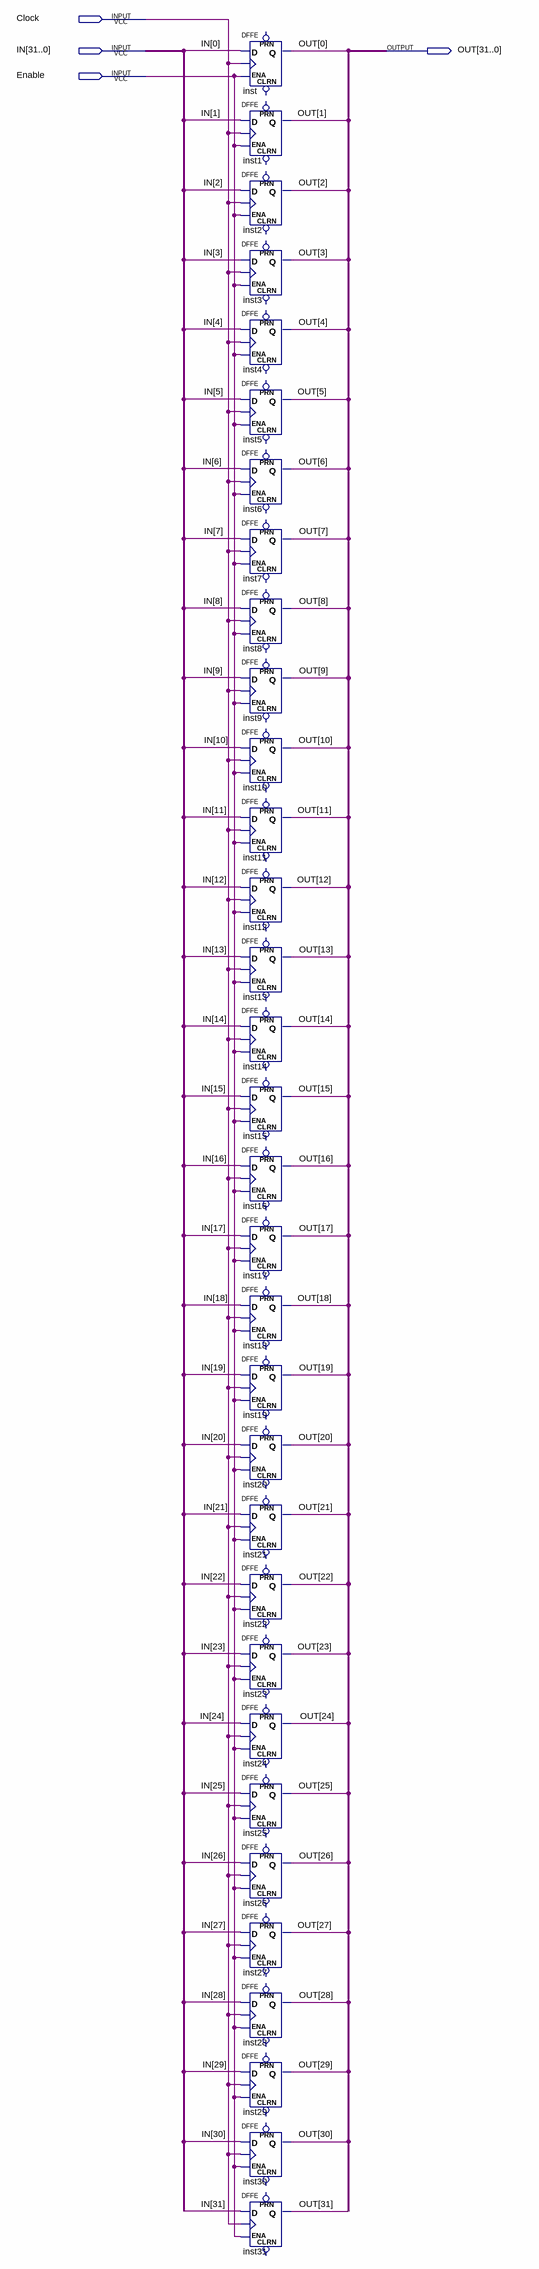
[diagram p0: schematic sheet]
// Quartus schematic registradorPedro.bdf as structural Verilog: 32 symbols, 4 pins
module registradorPedro (
  input  Clock,
  input  [31:0] IN,
  input  Enable,
  output [31:0] OUT
);

  DFFE inst (.D(IN[0]), .CLK(Clock), .ENA(Enable), .Q(OUT[0]));  // open: PRN, CLRN
  DFFE inst1 (.D(IN[1]), .CLK(Clock), .ENA(Enable), .Q(OUT[1]));  // open: PRN, CLRN
  DFFE inst2 (.D(IN[2]), .CLK(Clock), .ENA(Enable), .Q(OUT[2]));  // open: PRN, CLRN
  DFFE inst3 (.D(IN[3]), .CLK(Clock), .ENA(Enable), .Q(OUT[3]));  // open: PRN, CLRN
  DFFE inst4 (.D(IN[4]), .CLK(Clock), .ENA(Enable), .Q(OUT[4]));  // open: PRN, CLRN
  DFFE inst5 (.D(IN[5]), .CLK(Clock), .ENA(Enable), .Q(OUT[5]));  // open: PRN, CLRN
  DFFE inst6 (.D(IN[6]), .CLK(Clock), .ENA(Enable), .Q(OUT[6]));  // open: PRN, CLRN
  DFFE inst7 (.D(IN[7]), .CLK(Clock), .ENA(Enable), .Q(OUT[7]));  // open: PRN, CLRN
  DFFE inst8 (.D(IN[8]), .CLK(Clock), .ENA(Enable), .Q(OUT[8]));  // open: PRN, CLRN
  DFFE inst9 (.D(IN[9]), .CLK(Clock), .ENA(Enable), .Q(OUT[9]));  // open: PRN, CLRN
  DFFE inst10 (.D(IN[10]), .CLK(Clock), .ENA(Enable), .Q(OUT[10]));  // open: PRN, CLRN
  DFFE inst11 (.D(IN[11]), .CLK(Clock), .ENA(Enable), .Q(OUT[11]));  // open: PRN, CLRN
  DFFE inst12 (.D(IN[12]), .CLK(Clock), .ENA(Enable), .Q(OUT[12]));  // open: PRN, CLRN
  DFFE inst13 (.D(IN[13]), .CLK(Clock), .ENA(Enable), .Q(OUT[13]));  // open: PRN, CLRN
  DFFE inst14 (.D(IN[14]), .CLK(Clock), .ENA(Enable), .Q(OUT[14]));  // open: PRN, CLRN
  DFFE inst15 (.D(IN[15]), .CLK(Clock), .ENA(Enable), .Q(OUT[15]));  // open: PRN, CLRN
  DFFE inst16 (.D(IN[16]), .CLK(Clock), .ENA(Enable), .Q(OUT[16]));  // open: PRN, CLRN
  DFFE inst17 (.D(IN[17]), .CLK(Clock), .ENA(Enable), .Q(OUT[17]));  // open: PRN, CLRN
  DFFE inst18 (.D(IN[18]), .CLK(Clock), .ENA(Enable), .Q(OUT[18]));  // open: PRN, CLRN
  DFFE inst19 (.D(IN[19]), .CLK(Clock), .ENA(Enable), .Q(OUT[19]));  // open: PRN, CLRN
  DFFE inst20 (.D(IN[20]), .CLK(Clock), .ENA(Enable), .Q(OUT[20]));  // open: PRN, CLRN
  DFFE inst21 (.D(IN[21]), .CLK(Clock), .ENA(Enable), .Q(OUT[21]));  // open: PRN, CLRN
  DFFE inst22 (.D(IN[22]), .CLK(Clock), .ENA(Enable), .Q(OUT[22]));  // open: PRN, CLRN
  DFFE inst23 (.D(IN[23]), .CLK(Clock), .ENA(Enable), .Q(OUT[23]));  // open: PRN, CLRN
  DFFE inst24 (.D(IN[24]), .CLK(Clock), .ENA(Enable), .Q(OUT[24]));  // open: PRN, CLRN
  DFFE inst25 (.D(IN[25]), .CLK(Clock), .ENA(Enable), .Q(OUT[25]));  // open: PRN, CLRN
  DFFE inst26 (.D(IN[26]), .CLK(Clock), .ENA(Enable), .Q(OUT[26]));  // open: PRN, CLRN
  DFFE inst27 (.D(IN[27]), .CLK(Clock), .ENA(Enable), .Q(OUT[27]));  // open: PRN, CLRN
  DFFE inst28 (.D(IN[28]), .CLK(Clock), .ENA(Enable), .Q(OUT[28]));  // open: PRN, CLRN
  DFFE inst29 (.D(IN[29]), .CLK(Clock), .ENA(Enable), .Q(OUT[29]));  // open: PRN, CLRN
  DFFE inst30 (.D(IN[30]), .CLK(Clock), .ENA(Enable), .Q(OUT[30]));  // open: PRN, CLRN
  DFFE inst31 (.D(IN[31]), .CLK(Clock), .ENA(Enable), .Q(OUT[31]));  // open: PRN, CLRN
endmodule
